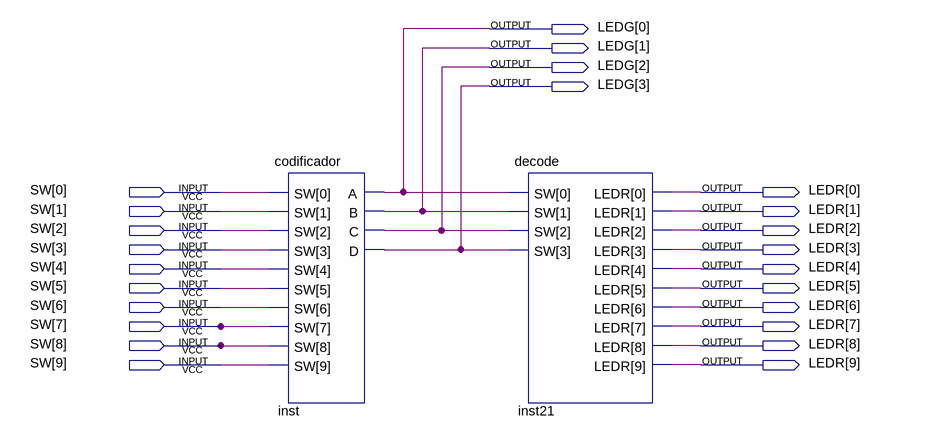
[diagram p0: schematic sheet]
// Quartus schematic lab6.bdf as structural Verilog: 2 symbols, 24 pins
module lab6 (
  input  [9:0] SW,
  output [3:0] LEDG,
  output [9:0] LEDR
);

  codificador inst (.SW(SW), .A(LEDG[0]), .B(LEDG[1]), .C(LEDG[2]), .D(LEDG[3]));
  decode inst21 (.SW(LEDG), .LEDR(LEDR));
endmodule
